# Altium schematic sheet PIC32MK1024MCM064.SchDoc
size A2; SheetNumber: 1; SheetTotal: 6
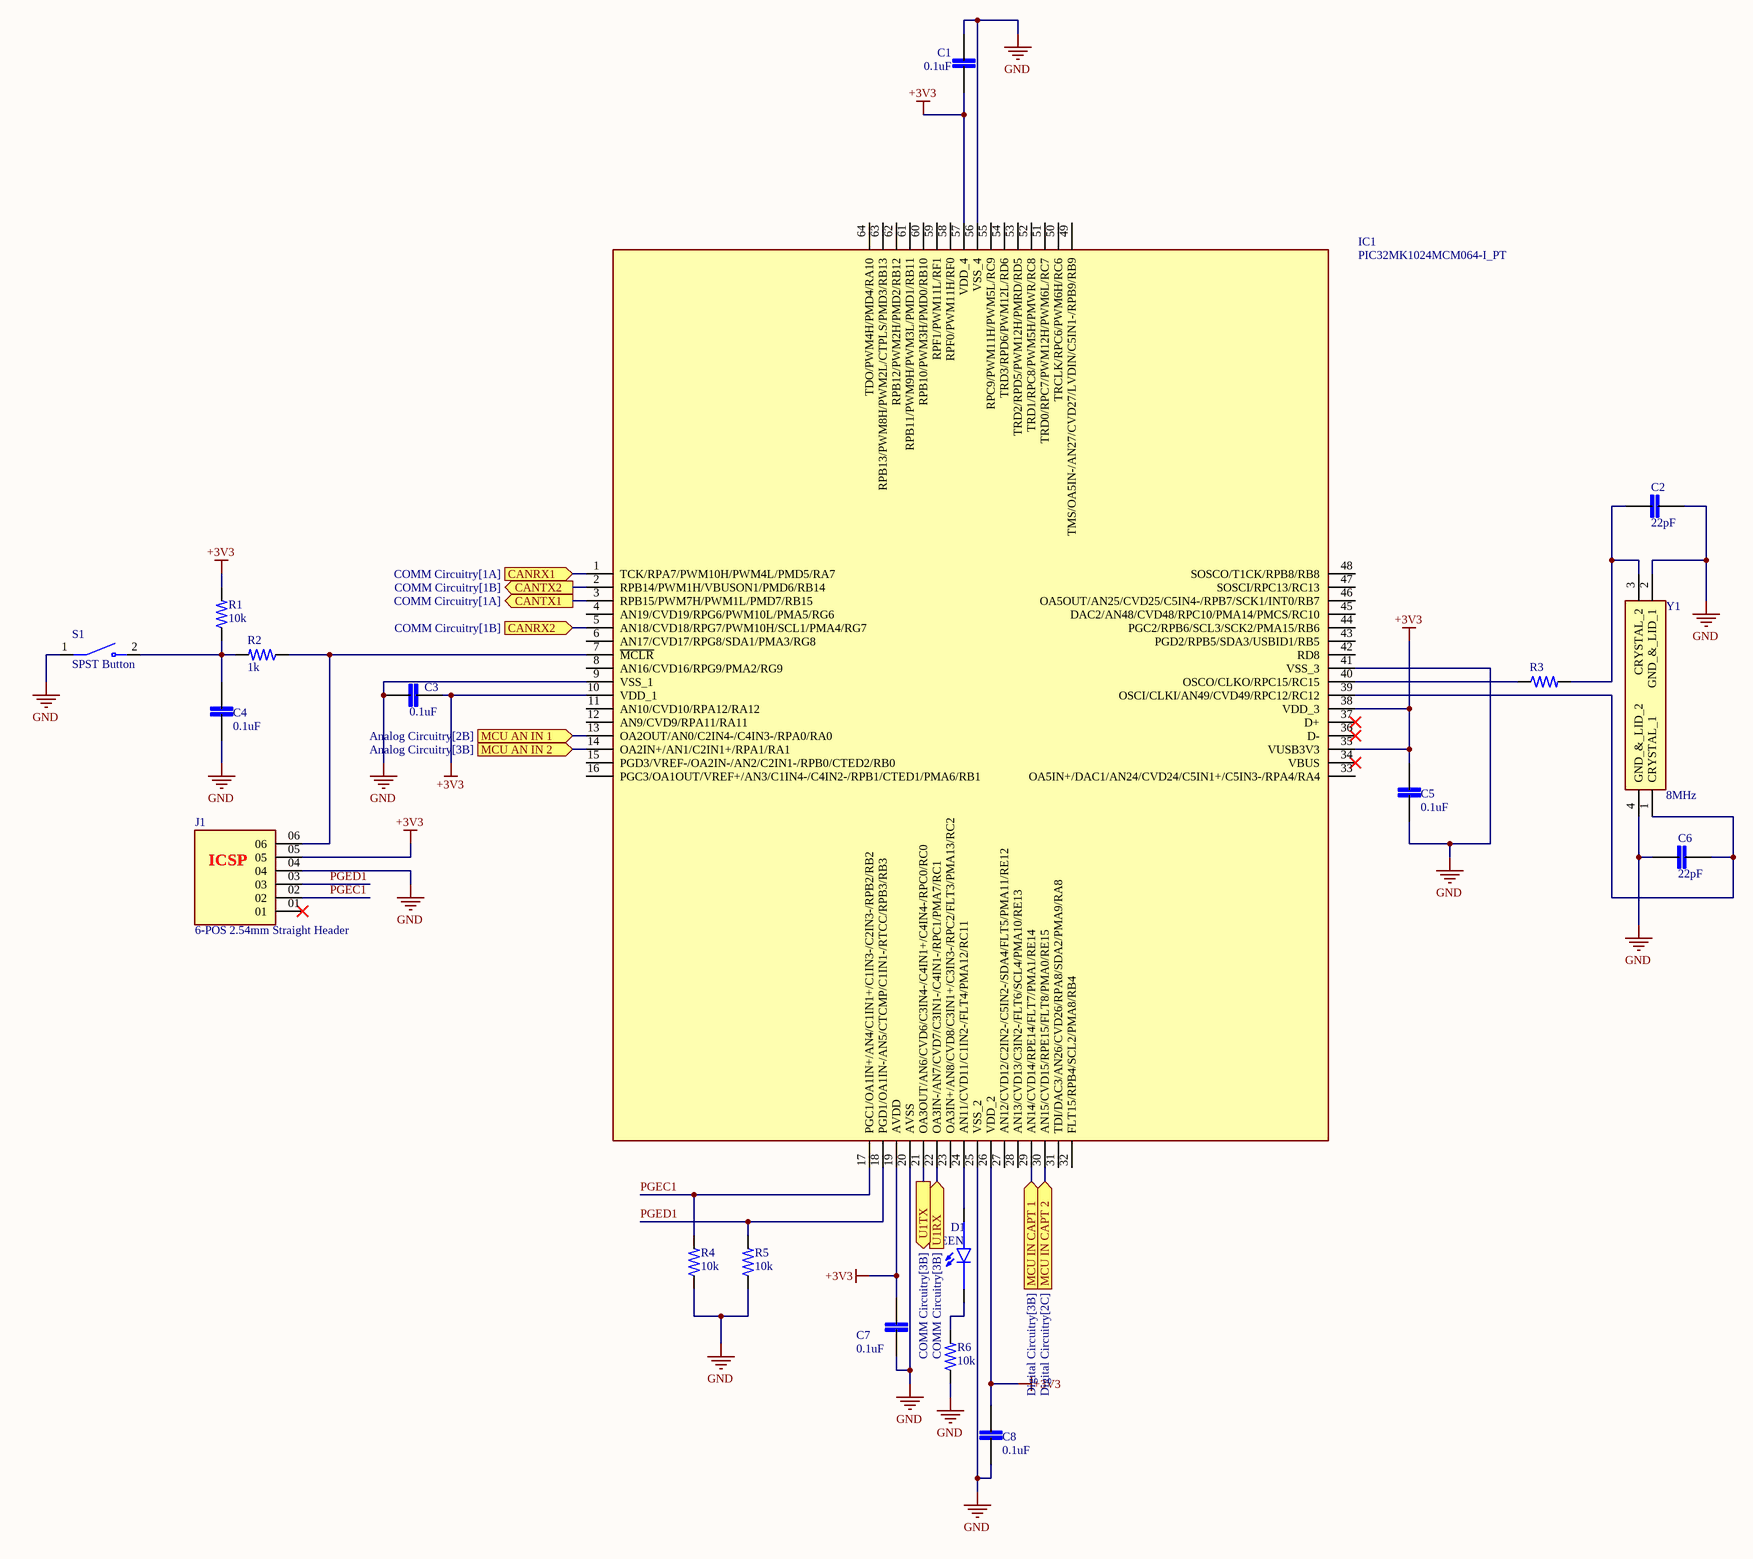
[diagram p0: PIC32MK1024MCM064.SchDoc]

## Parts
C1  0.1uF  [0805]
C2  22pF  [0805]
C3  0.1uF  [0805]
C4  0.1uF  [0805]
C5  0.1uF  [0805]
C6  22pF  [0805]
C7  0.1uF  [0805]
C8  0.1uF  [0805]
D1  GREEN  [LED 0805]
IC1  PIC32MK1024MCM064-I_PT  [PIC32MK1024MCM064-I_PT]
J1  6-POS 2.54mm Straight Header  [6-POS 2.54mm Header]
R1  10k  [0805]
R2  1k  [0805]
R3  0805_Resistor  [0805]  (value not drawn)
R4  10k  [0805]
R5  10k  [0805]
R6  10k  [0805]
S1  SPST Button  [SPST Button]
Y1  8MHz  [Crystal 5x3.2 - 4Pads]

## Ports
CANRX1 (in, see COMM Circuitry[1A]), CANRX2 (in, see COMM Circuitry[1B]), CANTX1 (out, see COMM Circuitry[1A]), CANTX2 (out, see COMM Circuitry[1B]), MCU AN IN 1 (in, see Analog Circuitry[2B]), MCU AN IN 2 (in, see Analog Circuitry[3B]), MCU IN CAPT 1 (in, see Digital Circuitry[3B]), MCU IN CAPT 2 (in, see Digital Circuitry[2C]), U1RX (in, see COMM Circuitry[3B]), U1TX (out, see COMM Circuitry[3B])

## Nets
+3V3: C1.2 C3.1 C5.2 C7.2 C8.2 IC1.10(VDD_1) IC1.19(AVDD) IC1.26(VDD_2) IC1.35(VUSB3V3) IC1.38(VDD_3) IC1.57(VDD_4) J1.05 R1.2
GND: C1.1 C2.2 C3.2 C4.1 C5.1 C6.1 C7.1 C8.1 IC1.9(VSS_1) IC1.20(AVSS) IC1.25(VSS_2) IC1.41(VSS_3) IC1.56(VSS_4) J1.04 R4.1 R5.1 R6.1 S1.1 Y1.2(GND_&_LID_1) Y1.4(GND_&_LID_2)
CANRX1: IC1.1(TCK/RPA7/PWM10H/PWM4L/PMD5/RA7) ; port CANRX1
CANRX2: IC1.5(AN18/CVD18/RPG7/PWM10H/SCL1/PMA4/RG7) ; port CANRX2
CANTX1: IC1.3(RPB15/PWM7H/PWM1L/PMD7/RB15) ; port CANTX1
CANTX2: IC1.2(RPB14/PWM1H/VBUSON1/PMD6/RB14) ; port CANTX2
MCU AN IN 1: IC1.13(OA2OUT/AN0/C2IN4-/C4IN3-/RPA0/RA0) ; port MCU AN IN 1
MCU AN IN 2: IC1.14(OA2IN+/AN1/C2IN1+/RPA1/RA1) ; port MCU AN IN 2
MCU IN CAPT 1: IC1.29(AN14/CVD14/RPE14/FLT7/PMA1/RE14) ; port MCU IN CAPT 1
MCU IN CAPT 2: IC1.30(AN15/CVD15/RPE15/FLT8/PMA0/RE15) ; port MCU IN CAPT 2
PGEC1: IC1.17(PGC1/OA1IN+/AN4/C1IN1+/C1IN3-/C2IN3-/RPB2/RB2) J1.02 R4.2
PGED1: IC1.18(PGD1/OA1IN-/AN5/CTCMP/C1IN1-/RTCC/RPB3/RB3) J1.03 R5.2
U1RX: IC1.22(OA3IN-/AN7/CVD7/C3IN1-/C4IN1-/RPC1/PMA7/RC1) ; port U1RX
U1TX: IC1.21(OA3OUT/AN6/CVD6/C3IN4-/C4IN1+/C4IN4-/RPC0/RC0) ; port U1TX
NetC2_1: C2.1 R3.2 Y1.3(CRYSTAL_2)
NetC4_2: C4.2 R1.1 R2.2 S1.2
NetC6_2: C6.2 IC1.39(OSCI/CLKI/AN49/CVD49/RPC12/RC12) Y1.1(CRYSTAL_1)
NetD1_A: D1.A IC1.24(AN11/CVD11/C1IN2-/FLT4/PMA12/RC11)
NetD1_C: D1.C R6.2
NetIC1_7: IC1.7(~{MCLR}) J1.06 R2.1
NetIC1_40: IC1.40(OSCO/CLKO/RPC15/RC15) R3.1

Not connected (* = marked no-connect by the designer): IC1 4(AN19/CVD19/RPG6/PWM10L/PMA5/RG6) 6(AN17/CVD17/RPG8/SDA1/PMA3/RG8) 8(AN16/CVD16/RPG9/PMA2/RG9) 11(AN10/CVD10/RPA12/RA12) 12(AN9/CVD9/RPA11/RA11) 15(PGD3/VREF-/OA2IN-/AN2/C2IN1-/RPB0/CTED2/RB0) 16(PGC3/OA1OUT/VREF+/AN3/C1IN4-/C4IN2-/RPB1/CTED1/PMA6/RB1) 23(OA3IN+/AN8/CVD8/C3IN1+/C3IN3-/RPC2/FLT3/PMA13/RC2) 27(AN12/CVD12/C2IN2-/C5IN2-/SDA4/FLT5/PMA11/RE12) 28(AN13/CVD13/C3IN2-/FLT6/SCL4/PMA10/RE13) 31(TDI/DAC3/AN26/CVD26/RPA8/SDA2/PMA9/RA8) 32(FLT15/RPB4/SCL2/PMA8/RB4) 33(OA5IN+/DAC1/AN24/CVD24/C5IN1+/C5IN3-/RPA4/RA4) 34(VBUS)* 36(D-)* 37(D+)* 42(RD8) 43(PGD2/RPB5/SDA3/USBID1/RB5) 44(PGC2/RPB6/SCL3/SCK2/PMA15/RB6) 45(DAC2/AN48/CVD48/RPC10/PMA14/PMCS/RC10) 46(OA5OUT/AN25/CVD25/C5IN4-/RPB7/SCK1/INT0/RB7) 47(SOSCI/RPC13/RC13) 48(SOSCO/T1CK/RPB8/RB8) 49(TMS/OA5IN-/AN27/CVD27/LVDIN/C5IN1-/RPB9/RB9) 50(TRCLK/RPC6/PWM6H/RC6) 51(TRD0/RPC7/PWM12H/PWM6L/RC7) 52(TRD1/RPC8/PWM5H/PMWR/RC8) 53(TRD2/RPD5/PWM12H/PMRD/RD5) 54(TRD3/RPD6/PWM12L/RD6) 55(RPC9/PWM11H/PWM5L/RC9) 58(RPF0/PWM11H/RF0) 59(RPF1/PWM11L/RF1) 60(RPB10/PWM3H/PMD0/RB10) 61(RPB11/PWM9H/PWM3L/PMD1/RB11) 62(RPB12/PWM2H/PMD2/RB12) 63(RPB13/PWM8H/PWM2L/CTPLS/PMD3/RB13) 64(TDO/PWM4H/PMD4/RA10); J1 01*

## Notes on the sheet
- (near J1) ICSP

## Library data of the parts
C1-C8 = 0805_Capacitor: MP: LD051A121KAB2A; MF: AVX; SnapEDA_Link: https://www.snapeda.com/parts/LD051A121KAB2A/AVX/view-part/?ref=snap; Package: 0805 AVX; Check_prices: https://www.snapeda.com/parts/LD051A121KAB2A/AVX/view-part/?ref=eda; Purchase-URL: https://pricing.snapeda.com/search/part/LD051A121KAB2A/?ref=eda; Price: None; Value: *; Availability: In Stock
D1 = LED 0805: LED Uni-Color Green 4-Pin Chip 0805 T/R; MP: 597-3305-607F; Availability: Unavailable; Value: *; Price: None; Package: None
IC1 = PIC32MK1024MCM064-I_PT: Integrated Circuit; Manufacturer_Name: Microchip; Manufacturer_Part_Number: PIC32MK1024MCM064-I/PT; Datasheet Link: https://ww1.microchip.com/downloads/aemDocuments/documents/MCU32/ProductDocuments/DataSheets/PIC32MK-GPK-MCM-with-CAN-FD-Family-DataSheet-DS60001519E.pdf; Height: 1.2mm; Mouser Part Number: 579-2MK1024MCM064IPT; Mouser Price/Stock: https://www.mouser.co.uk/ProductDetail/Microchip-Technology/PIC32MK1024MCM064-I-PT?qs=W%2FMpXkg%252BdQ4dBI32NJdQMg%3D%3D; Arrow Part Number: PIC32MK1024MCM064-I/PT; Arrow Price/Stock: https://www.arrow.com/en/products/pic32mk1024mcm064-ipt/microchip-technology?region=nac
J1 = 6-POS 2.54mm Straight Header: HEADER, 6 CONTACTS, 1 ROW, THROUGH HOLE, 2.54 MM; Connector Systems:Board-to-Board; Pitch Spacing:2.54mm; No. of Rows:1Rows; No. of Contacts:6Contacts; Contact Termination Type:Through Hole Right Angle; Product Range:HTSW Series RoHS Compliant: Yes; MP: HTSW10608SSLA; MF: Samtec; Purchase-URL: https://pricing.snapeda.com/search/part/HTSW10608SSLA/?ref=eda; Package: None; Check_prices: https://www.snapeda.com/parts/HTSW10608SSLA/Samtec/view-part/?ref=eda; Price: None; SnapEDA_Link: https://www.snapeda.com/parts/HTSW10608SSLA/Samtec/view-part/?ref=snap; Availability: In Stock; Value: *
R1-R6 = 0805_Resistor: Power_Rating: .25 W; MP: 2-2176053-0; Tolerance: 1%; Resistance: .33; MF: TE Connectivity; Price: None; Availability: In Stock; EU_RoHS_Compliance: Compliant with Exemptions; Package: 0805; Value: *; SnapEDA_Link: https://www.snapeda.com/parts/2-2176053-0/TE+Connectivity/view-part/?ref=snap; Check_prices: https://www.snapeda.com/parts/2-2176053-0/TE+Connectivity/view-part/?ref=eda
S1 = SPST Button: 3mmX6mm; MP: B3U-1000P; Price: None; Availability: Unavailable; Value: *; Package: None
Y1 = Crystal 5x3.2 - 4Pads: Crystal or Oscillator; Manufacturer_Name: Wurth Elektronik; Manufacturer_Part_Number: 830106162701; Datasheet Link: https://www.we-online.com/components/products/datasheet/830106162701.pdf; Height: 1mm; Mouser Part Number: 710-830106162701; Mouser Price/Stock: https://www.mouser.co.uk/ProductDetail/Wurth-Elektronik/830106162701?qs=hd1VzrDQEGiB2nVeND4SIw%3D%3D